# EAGLE design relay_switch (EAGLE 9.1.3)
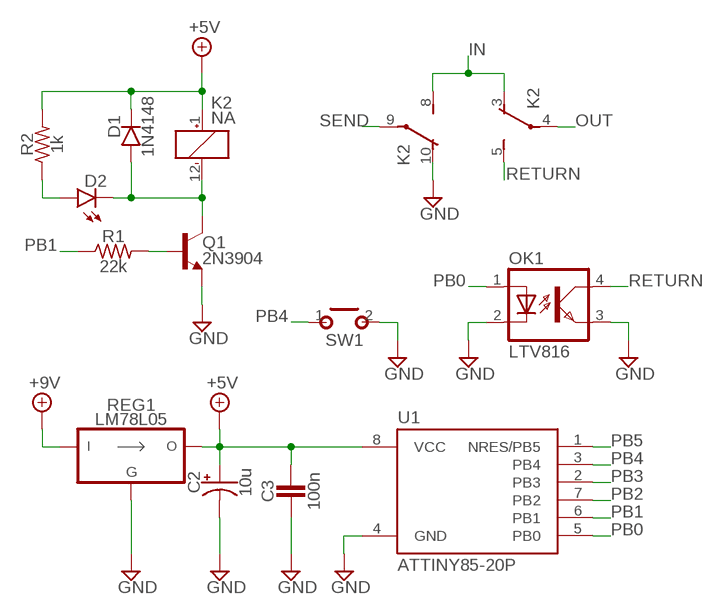
[diagram p0: schematic, sheet 1]

## Parts
C2  10u  0500  [050_020]
C3  100n  CER/FILM2  [050X030_025_2]
D1  1N4148  DO35.2  [DO35-2]
D2  LED  [3MM_D]
K2  NA  [NA]
OK1  LTV816  [DIL04]
Q1  2N3904  [TO92-]
R1  22k  R_.3B  [R0207/3]
R2  1k  R_.3B  [R0207/3]
REG1  LM78L05  [TO92-]
SW1  MOMENTARY  [SPST]
U1  ATTINY85-20P  [PDIP08_300MIL]

## Nets
+5V: C2.+ C3.1 D1.C K2.1(1:+) R2.2 REG1.3(VO) U1.8(VCC)
+9V: REG1.1(VI)
GND: C2.- C3.2 K2.10(3:O) OK1.2(C) OK1.3(EMIT) Q1.3(E) REG1.2(GND) SW1.2(S) U1.4(GND)
IN: K2.3(2:O) K2.8(3:S)
N$2: D1.A D2.P$1(C) K2.12(1:-) Q1.1(C)
N$3: Q1.2(B) R1.2
N$4: D2.ANODE(A) R2.1
OUT: K2.4(2:P)
PB0: OK1.1(A) U1.5(PB0)
PB1: R1.1 U1.6(PB1)
PB2: U1.7(PB2)
PB3: U1.2(PB3)
PB4: SW1.1(P) U1.3(PB4)
PB5: U1.1(NRES/PB5)
RETURN: K2.5(2:S) OK1.4(COL)
SEND: K2.9(3:P)

## Library data of the parts
C2 = pedals-capacitors-elec:050
C3 = pedals-capacitors-film:CER/FILM: 47 - 120pF Xicon Ceramic Disc 2.5mm lead spacing
D1 = pedals-diodes:DO35: DO-35 Package Diodes: 1N914
D2 = pedals-diodes:LED
K2 = pedals-relays:NA: RELAY; OC_FARNELL: unknown; OC_NEWARK: unknown
OK1 = pedals-integrated circuits:LTV816: OPTO COUPLER Source: LITEON, LTV816.pdf; OC_FARNELL: unknown; OC_NEWARK: unknown
Q1 = pedals-transistors:2N3904: NPN Transistor
R1 R2 = pedals-resistors:R_
REG1 = pedals-regulators:LM78L05
SW1 = pedals-switches:MOMENTARY
U1 = pedals-microcontrollers:ATTINY85*: ATMEL ATtiny 85 Packages: P = PDIP 08 30mil S = SOIC 08 EIAJ 208mil Technologies Note: for complete ordering code (temp. range, finish, tape&reel etc.) see www.atmel.com • Supply Voltage: V = (1.8…5.5)V | [blank] = (2.7…5.5)V • Speed: 10 = 10 MHz | 20 = 20 MHz Author: Dipl.-Ing. FH Rainer Bayer HHN Hochschule Heilbronn (Heilbronn University), rainer.bayer@hs-heilbronn.de Ingenieurbüro ing-rb, mail@ing-rb.de

## Board
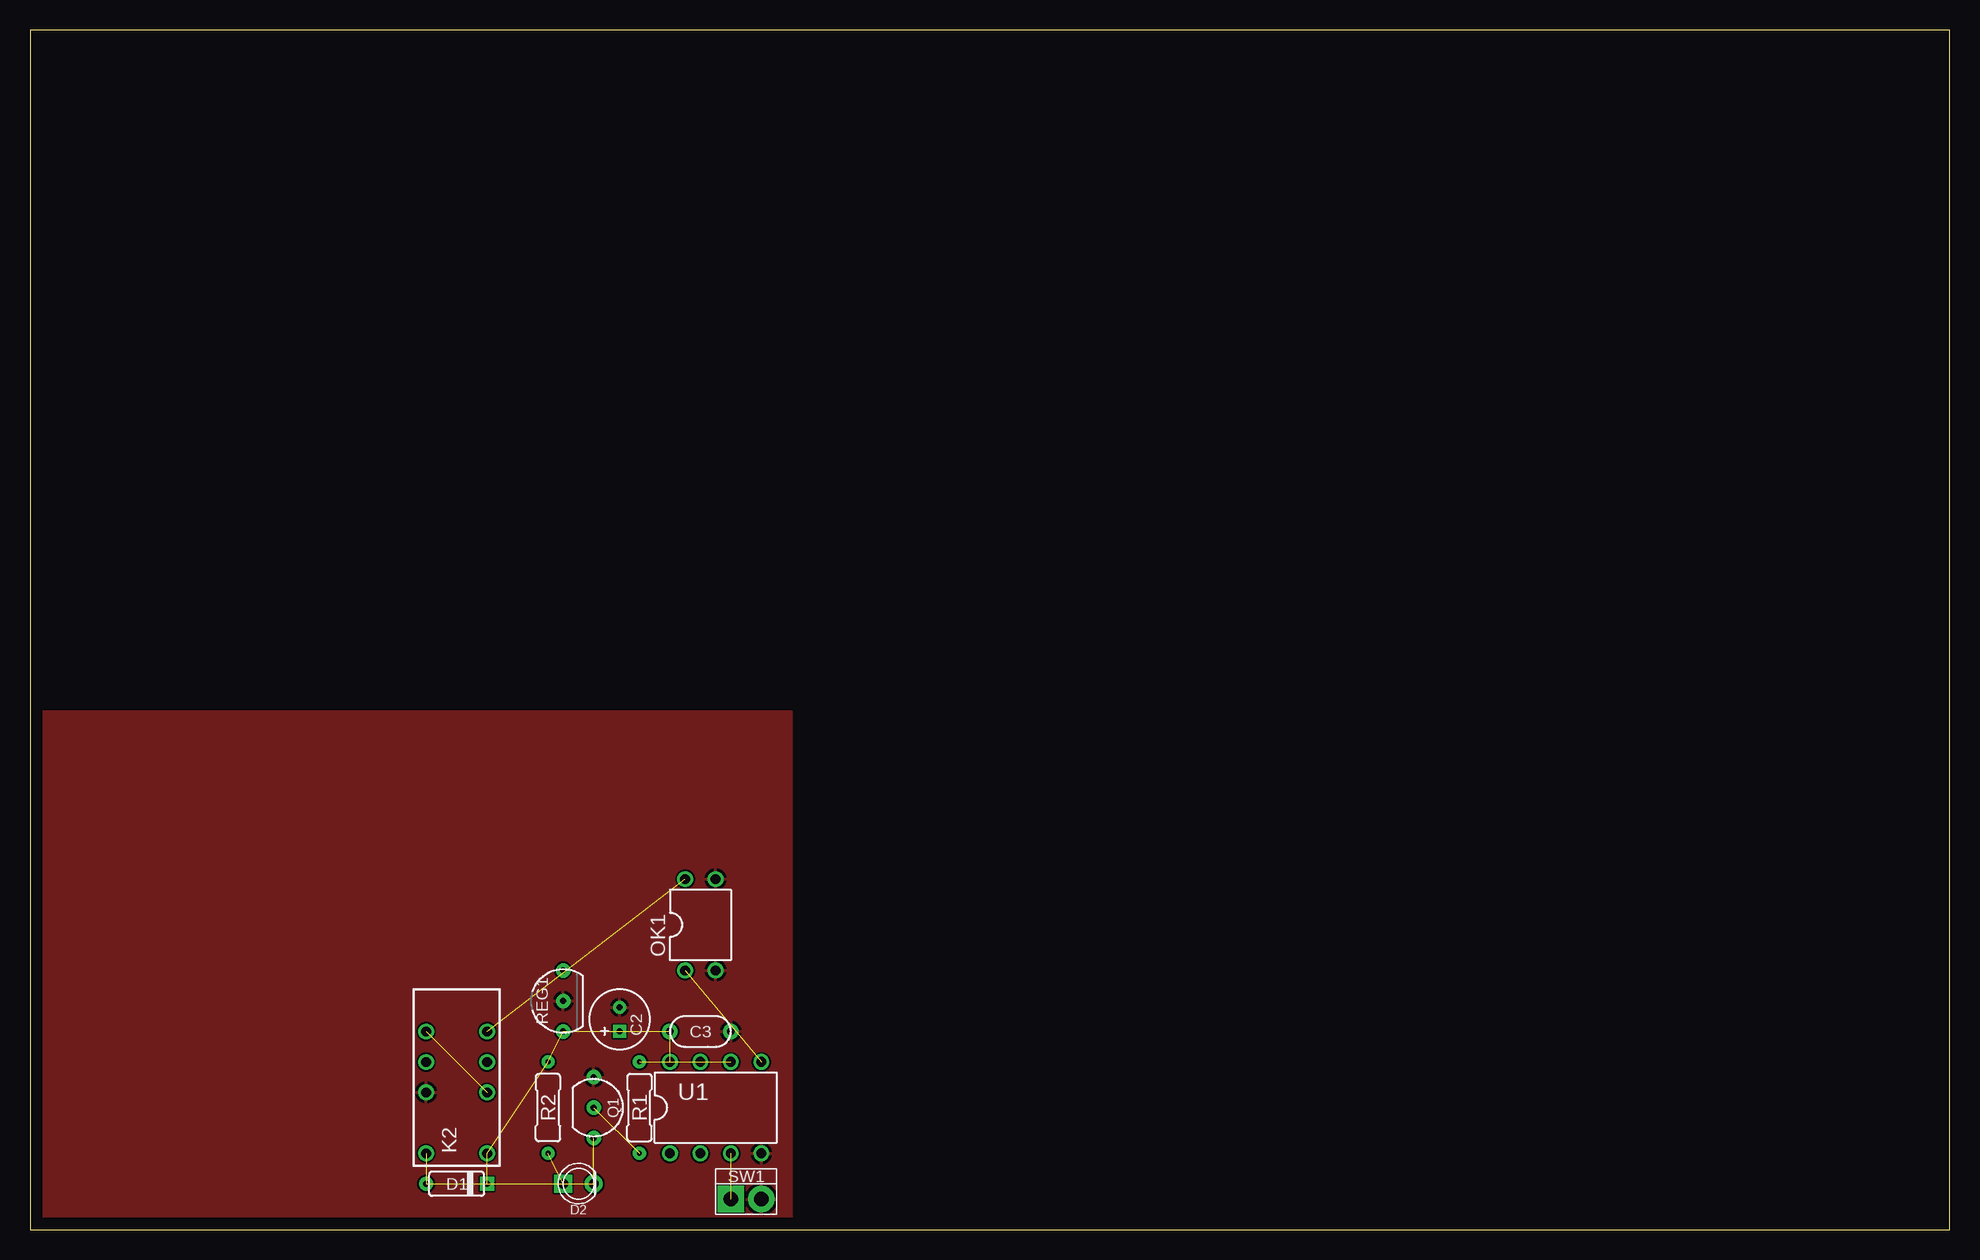
[diagram p1: board, top side]
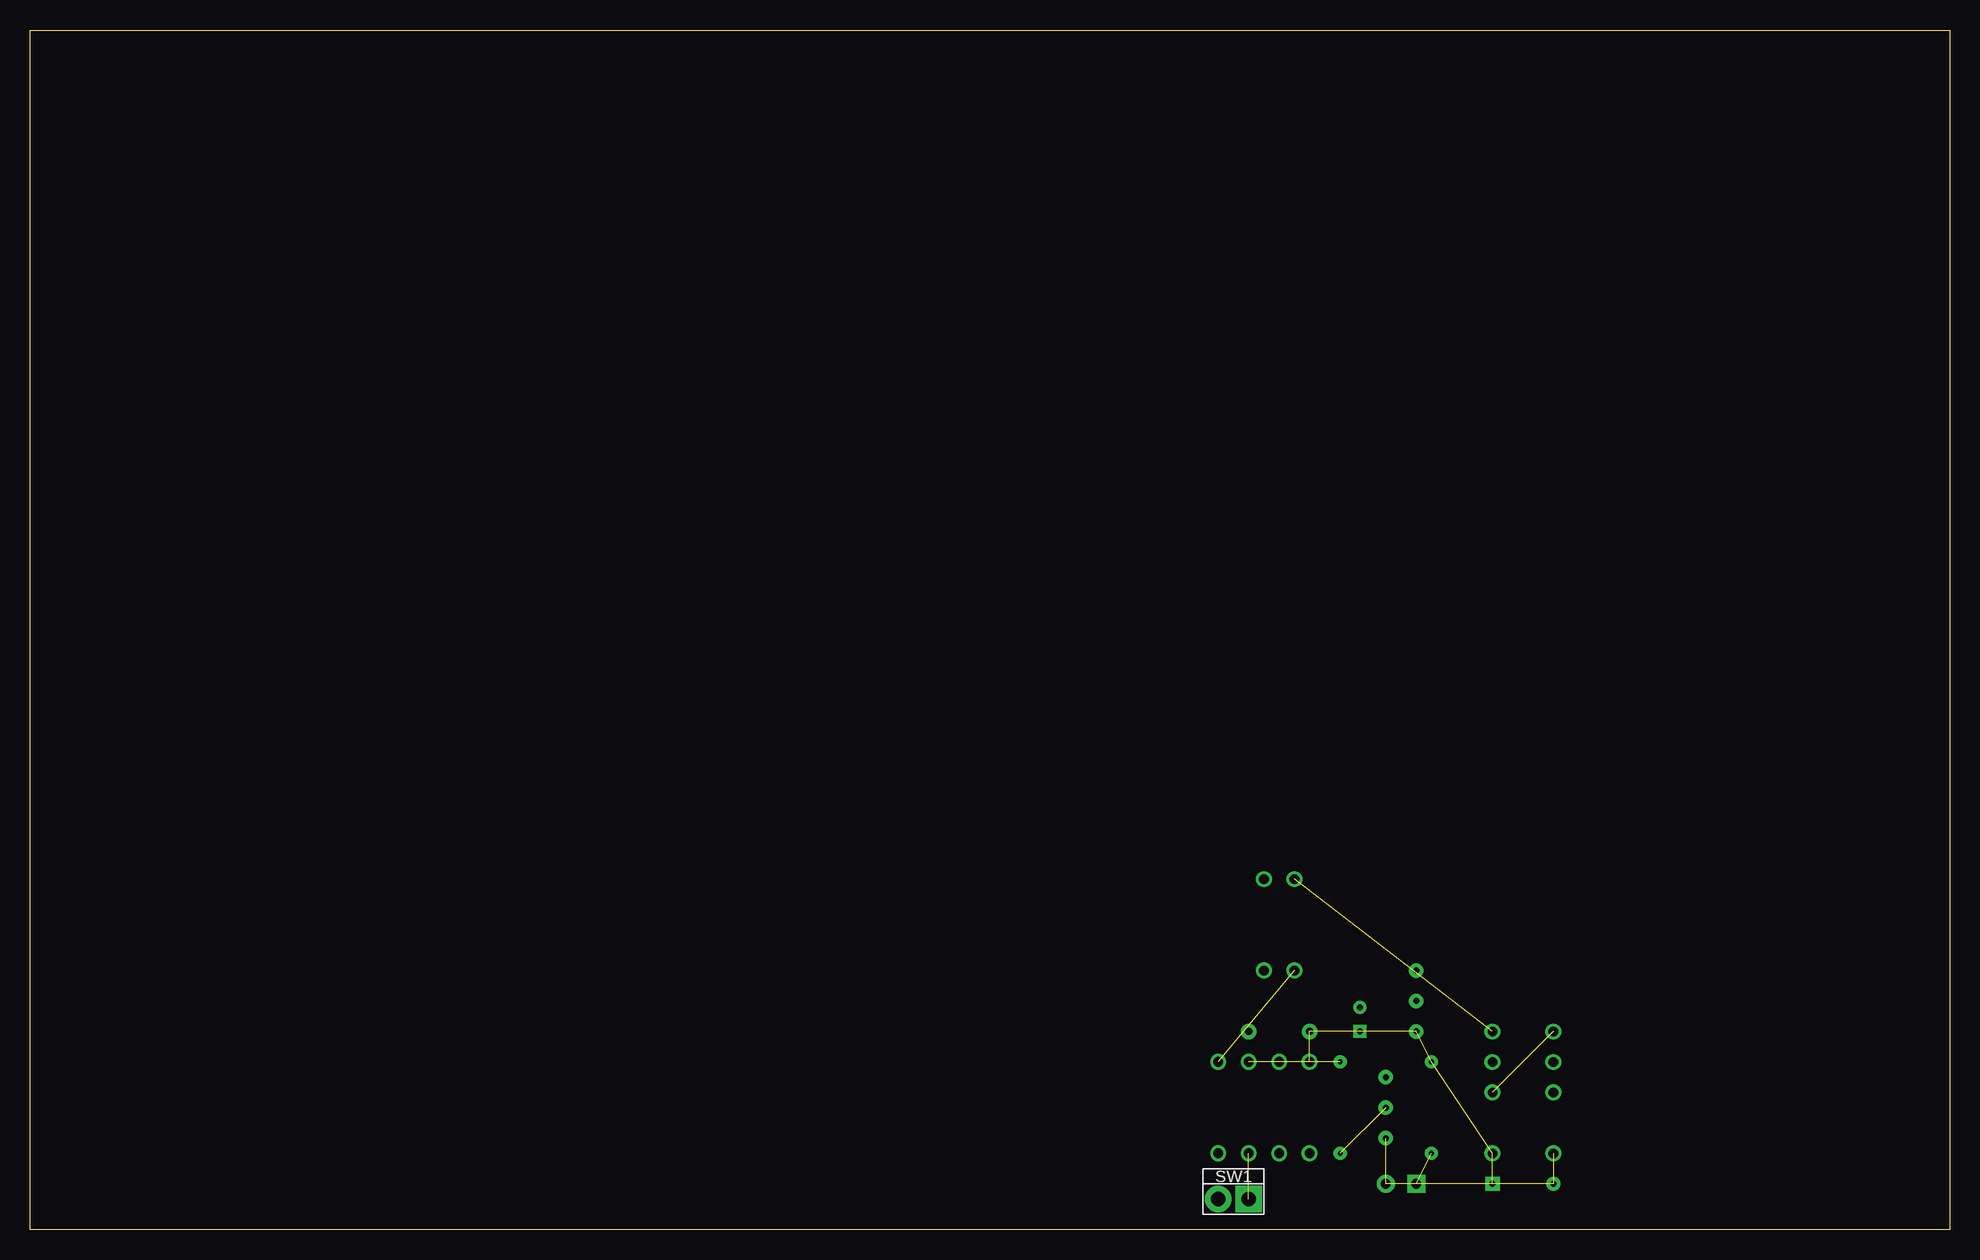
[diagram p2: board, bottom side, seen from below]

Size 160 x 100 mm. Coordinates in mm from the lower left corner, seen from the top.
Outline: 0,0 160,0 160,100 0,100 0,0
Copper layers (1*16): Top 0.035mm / dielectric 1.5mm / Bottom 0.035mm
Design rules "default": minimum track width 6mil, minimum drill 0.35mm, track to track 6mil, track to pad 6mil, pad to pad 6mil, via to via 6mil, smd to smd 6mil, copper to edge 40mil, drill to drill 6mil, minimum pad ring 10mil, minimum via ring 8mil, stop-mask expansion 4mil, vias tented up to drill 0mil, thermal gap 10mil

### Footprints (pad centres in the part's own frame; a part is rotated, then mirrored left to right if it is on the bottom)
050_020 = drill 0.5 pad 1.1 square: + -0.998,0.001 | drill 0.5 pad 1.1: - 0.998,0.001
050X030_025_2 = drill 0.6 pad 1.3: 1 -2.54,0; 2 2.54,0
DO35-2 = drill 0.5 pad 1.2: A 2.54,0 | drill 0.5 pad 1.2 square: C -2.54,0
3MM_D = drill 0.8 pad 1.5 square: ANODE -1.27,0 | drill 0.8 pad 1.5: P$1 1.27,0
NA = drill 0.8: 1 -6.35,-2.54; 3 -1.27,-2.54; 4 1.27,-2.54; 5 3.81,-2.54; 8 3.81,2.54; 9 1.27,2.54; 10 -1.27,2.54; 12 -6.35,2.54
DIL04 = drill 0.813 pad 1.27: 1 -1.27,-3.81; 2 1.27,-3.81; 3 1.27,3.81; 4 -1.27,3.81
TO92- = drill 0.5 pad 1.2: 1 2.54,0; 2 0,0; 3 -2.54,0
R0207/3 = drill 0.4 pad 1.1: 1 -3.81,0; 2 3.81,0
TO92-' = drill 0.5 pad 1.194: 1 -2.54,0; 2 0,0; 3 2.54,0
SPST = drill 1.2 pad 2.184 square: 1 -1.27,0 | drill 1.2 pad 2.184: 2 1.27,0
PDIP08_300MIL = drill 0.813: 1 -3.81,-3.81; 2 -1.27,-3.81; 3 1.27,-3.81; 4 3.81,-3.81; 5 3.81,3.81; 6 1.27,3.81; 7 -1.27,3.81; 8 -3.81,3.81

### Placement (x,y rotation side)
C2  49.15,17.53 90 top
C3  55.88,16.51 0 top
D1  35.56,3.81 180 top
D2  45.72,3.81 0 top
K2  35.56,12.7 90 top
OK1  55.88,25.4 0 top
Q1  46.99,10.16 270 top
R1  50.8,10.16 270 top
R2  43.18,10.16 90 top
REG1  LM78L05  [TO92-']  44.45,19.05 270 top
SW1  59.69,2.54 0 top
U1  57.15,10.16 0 top

### Tracks (layer width: path | path; a pad name or v marks a point on that pad's centre or on a via)
+5V  (6 unrouted)
GND
  pour Top: 0,43.18 0,0 63.5,0 63.5,43.18
IN  (1 unrouted)
N$2  (3 unrouted)
N$3  (1 unrouted)
N$4  (1 unrouted)
PB0  (1 unrouted)
PB1  (1 unrouted)
PB4  (1 unrouted)
RETURN  (1 unrouted)